# EAGLE design minipov (EAGLE 6.1)
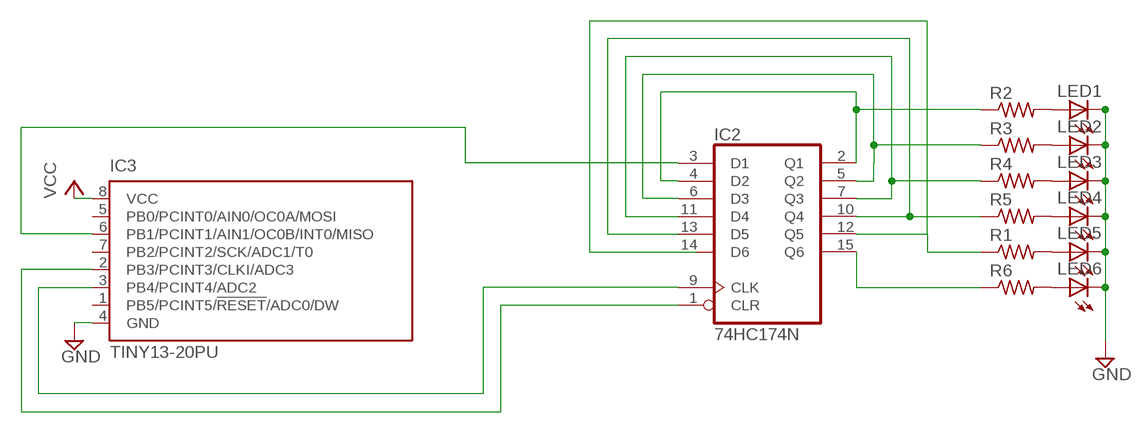
[diagram p0: schematic, sheet 1]

## Parts
IC2  74HC174N  [DIL16]
IC3  TINY13-20PU  [DIL08]
LED1  LED10MM  [LED10MM]
LED2  LED10MM  [LED10MM]
LED3  LED10MM  [LED10MM]
LED4  LED10MM  [LED10MM]
LED5  LED10MM  [LED10MM]
LED6  LED10MM  [LED10MM]
R1  R-US_0207/5V  [0207/5V]
R2  R-US_0207/5V  [0207/5V]
R3  R-US_0207/5V  [0207/5V]
R4  R-US_0207/5V  [0207/5V]
R5  R-US_0207/5V  [0207/5V]
R6  R-US_0207/5V  [0207/5V]

## Nets
GND: IC3.4(GND) LED1.K(C) LED2.K(C) LED3.K(C) LED4.K(C) LED5.K(C) LED6.K(C)
N$1: IC2.1(CLR) IC3.2(PB3/PCINT3/CLKI/ADC3)
N$2: IC2.9(CLK) IC3.3(PB4/PCINT4/ADC2)
N$3: IC2.3(D1) IC3.6(PB1/PCINT1/AIN1/OC0B/INT0/MISO)
N$6: IC2.7(Q3) IC2.11(D4) R4.1
N$7: IC2.10(Q4) IC2.13(D5) R5.1
N$8: IC2.12(Q5) R1.1
N$9: IC2.2(Q1) IC2.4(D2) R2.1
N$10: IC2.5(Q2) IC2.6(D3) R3.1
N$12: IC2.15(Q6) R6.1
N$13: LED1.A R2.2
N$14: LED2.A R3.2
N$15: LED3.A R4.2
N$16: LED4.A R5.2
N$17: LED5.A R1.2
N$18: LED6.A R6.2
VCC: IC3.8(VCC)
Unconnected: IC2.14(D6) IC3.1(PB5/PCINT5/!RESET!/ADC0/DW) IC3.5(PB0/PCINT0/AIN0/OC0A/MOSI) IC3.7(PB2/PCINT2/SCK/ADC1/T0)

## Power pins joined to a net without a drawn wire
GND: IC2.8(GND)
VCC: IC2.16(VCC)

## Library data of the parts
IC2 = 74xx-eu:74*174: Hex D type FLIP FLOP, clear
IC3 = atmel:TINY13: 8-bit AVR Microcontroller with 1K Bytes In-System Programmable Flash Source: http://www.atmel.com/dyn/resources/prod_documents/2535S.pdf; MPN: ATTINY13-20PU; OC_FARNELL: 9171550; OC_NEWARK: 96K6521
LED1-LED6 = led:LED: LED OSRAM: - CHIPLED LG R971, LG N971, LY N971, LG Q971, LY Q971, LO R971, LY R971 LH N974, LH R974 LS Q976, LO Q976, LY Q976 LO Q996 - Hyper CHIPLED LW Q18S LB Q993, LB Q99A, LB R99A - SideLED LS A670, LO A670, LY A670, LG A670, LP A670 LB A673, LV A673, LT A673, LW A673 LH A674 LY A675 LS A676, LA A676, LO A676, LY A676, LW A676 LS A679, LY A679, LG A679 - Hyper Micro SIDELED® LS Y876, LA Y876, LO Y876, LY Y876 LT Y87S - SmartLED LW L88C, LW L88S LB L89C, LB L89S, LG L890 LS L89K, LO L89K, LY L89K LS L896, LA L896, LO L896, LY L896 - TOPLED LS T670, LO T670, LY T670, LG T670, LP T670 LSG T670, LSP T670, LSY T670, LOP T670, LYG T670 LG T671, LOG T671, LSG T671 LB T673, LV T673, LT T673, LW T673 LH T674 LS T676, LA T676, LO T676, LY T676, LB T676, LH T676, LSB T676, LW T676 LB T67C, LV T67C, LT T67C, LS T67K, LO T67K, LY T67K, LW E67C LS E67B, LA E67B, LO E67B, LY E67B, LB E67C, LV E67C, LT E67C LW T67C LS T679, LY T679, LG T679 LS T770, LO T770, LY T770, LG T770, LP T770 LB T773, LV T773, LT T773, LW T773 LH T774 LS E675, LA E675, LY E675, LS T675 LS T776, LA T776, LO T776, LY T776, LB T776 LHGB T686 LT T68C, LB T68C - Hyper Mini TOPLED® LB M676 - Mini TOPLED Santana® LG M470 LS M47K, LO M47K, LY M47K Source: http://www.osram.convergy.de LUXEON: - LUMILED® LXK2-PW12-R00, LXK2-PW12-S00, LXK2-PW14-U00, LXK2-PW14-V00 LXK2-PM12-R00, LXK2-PM12-S00, LXK2-PM14-U00 LXK2-PE12-Q00, LXK2-PE12-R00, LXK2-PE12-S00, LXK2-PE14-T00, LXK2-PE14-U00 LXK2-PB12-K00, LXK2-PB12-L00, LXK2-PB12-M00, LXK2-PB14-N00, LXK2-PB14-P00, LXK2-PB14-Q00 LXK2-PR12-L00, LXK2-PR12-M00, LXK2-PR14-Q00, LXK2-PR14-R00 LXK2-PD12-Q00, LXK2-PD12-R00, LXK2-PD12-S00 LXK2-PH12-R00, LXK2-PH12-S00 LXK2-PL12-P00, LXK2-PL12-Q00, LXK2-PL12-R00 Source: www.luxeon.com KINGBRIGHT: KA-3528ASYC Source: www.kingbright.com
R1-R6 = resistor:R-US_: RESISTOR, American symbol

## Board
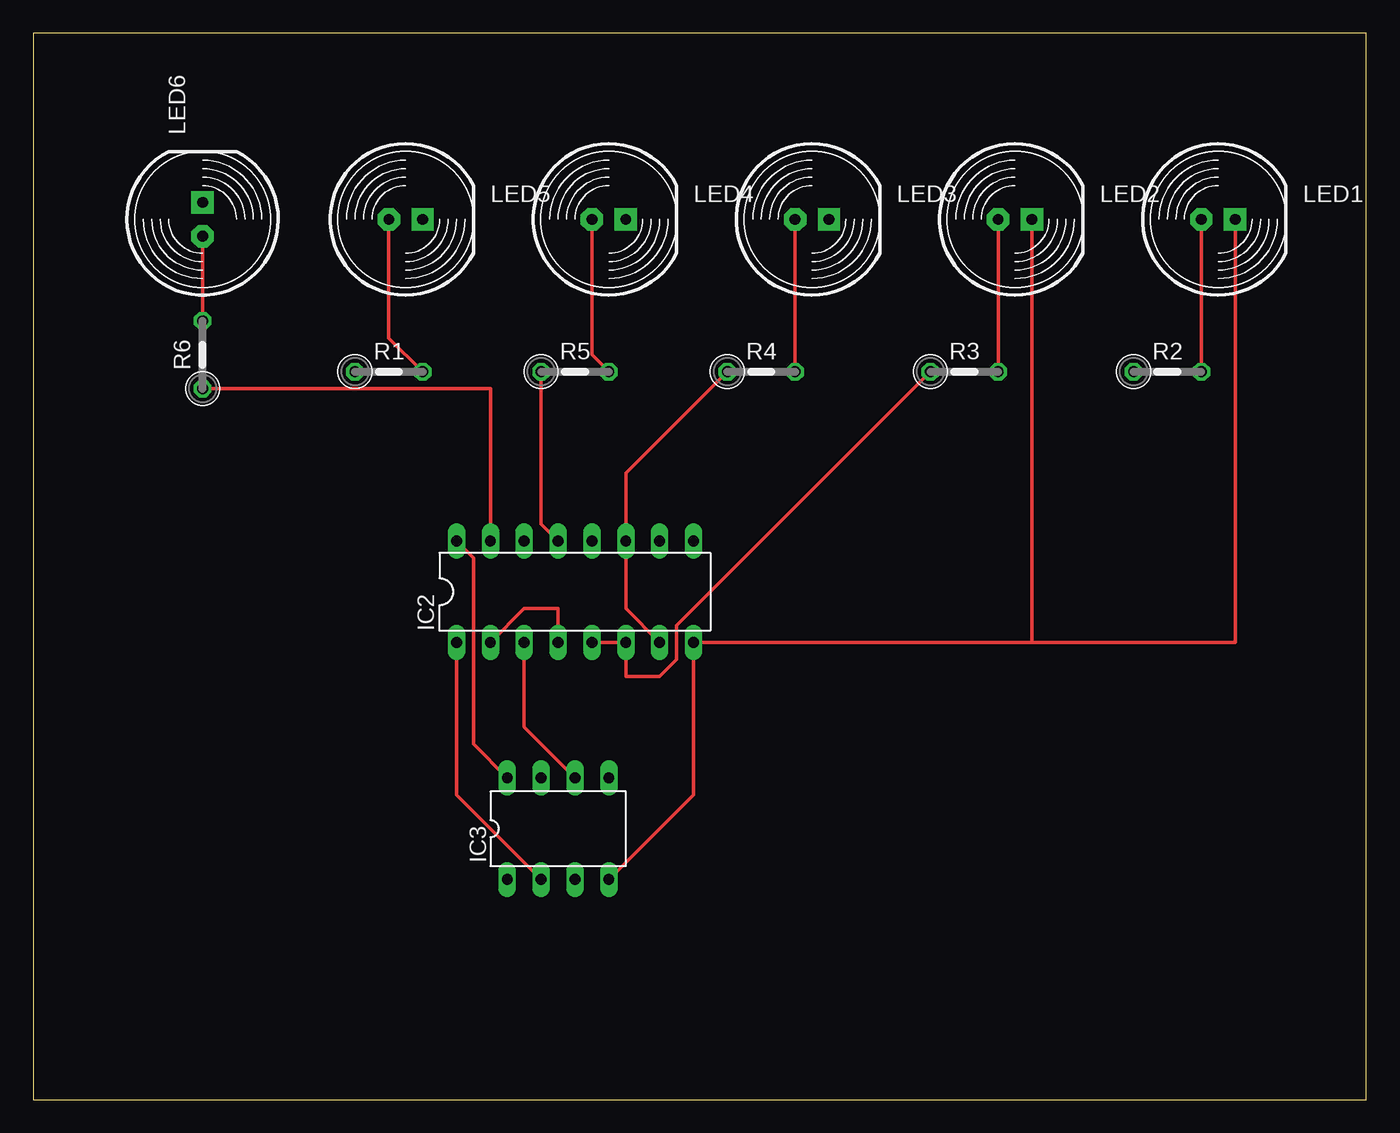
[diagram p1: board, top side]
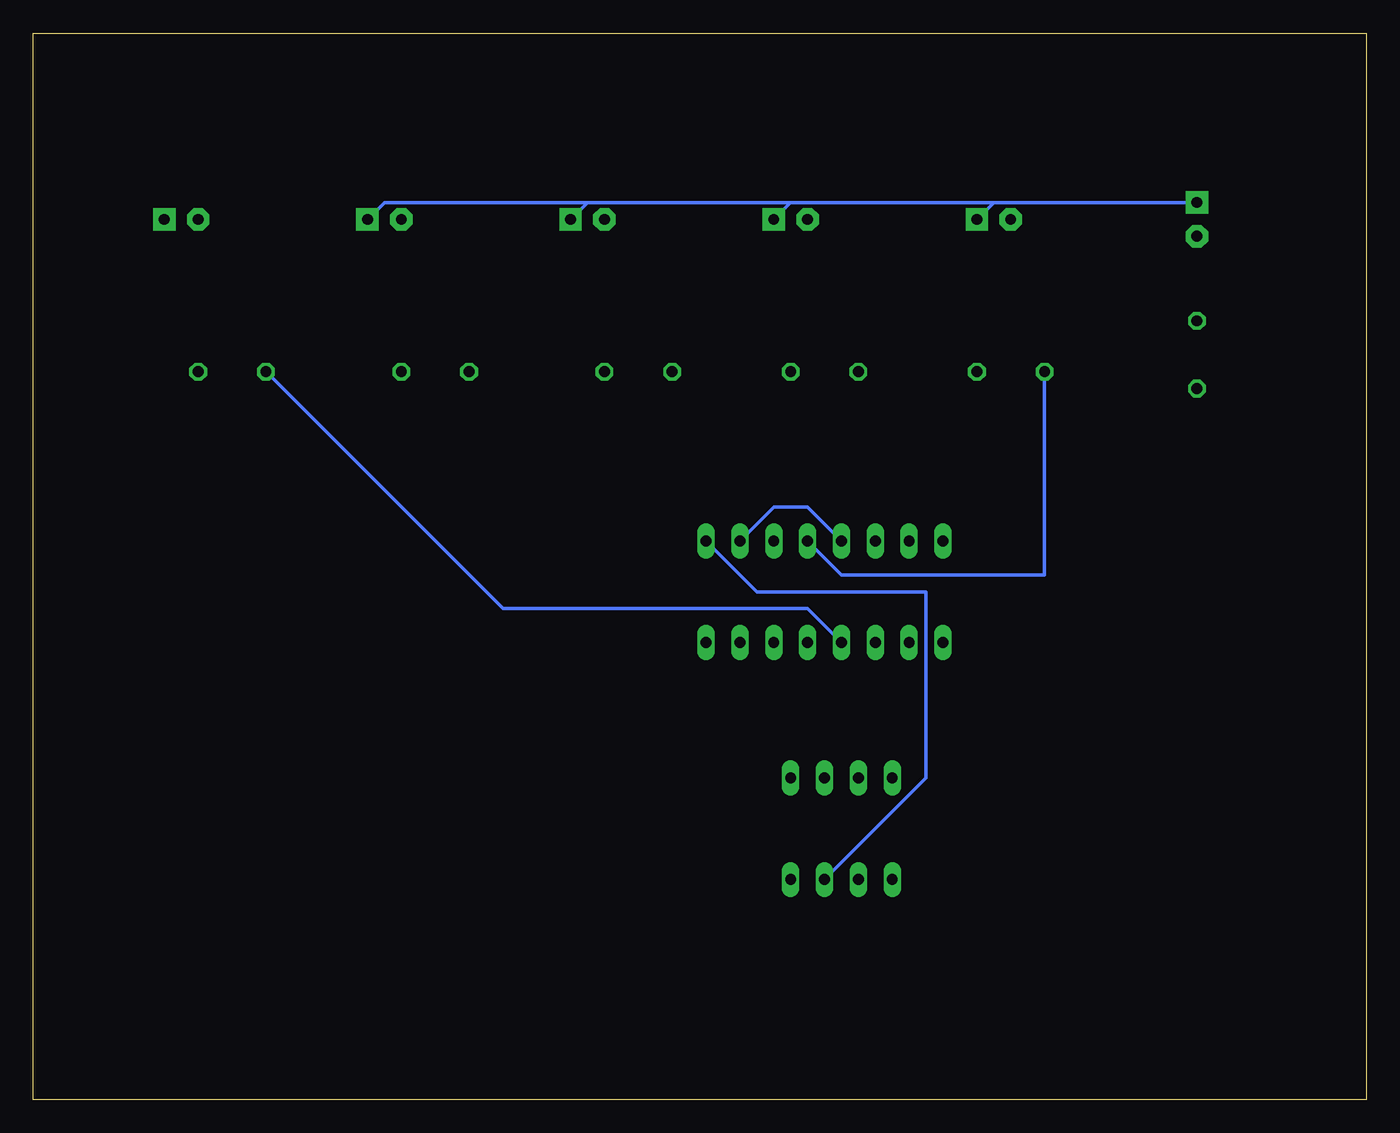
[diagram p2: board, bottom side, seen from below]

Size 100 x 80 mm. Coordinates in mm from the lower left corner, seen from the top.
Outline: 0,0 100,0 100,80 0,80 0,0
Copper layers (1*16): Top 0.035mm / dielectric 1.5mm / Bottom 0.035mm
Design rules: minimum track width 10mil, minimum drill 24mil, track to track 8mil, track to pad 8mil, pad to pad 8mil, via to via 8mil, smd to smd 8mil, copper to edge 40mil, drill to drill 8mil, minimum pad ring 10mil, minimum via ring 8mil, stop-mask expansion 4mil, vias tented up to drill 0mil, thermal gap 10mil

### Footprints (pad centres in the part's own frame; a part is rotated, then mirrored left to right if it is on the bottom)
DIL16 = drill 0.813 long: 1 -8.89,-3.81; 2 -6.35,-3.81; 3 -3.81,-3.81; 4 -1.27,-3.81; 5 1.27,-3.81; 6 3.81,-3.81; 7 6.35,-3.81; 8 8.89,-3.81; 9 8.89,3.81; 10 6.35,3.81; 11 3.81,3.81; 12 1.27,3.81; 13 -1.27,3.81; 14 -3.81,3.81; 15 -6.35,3.81; 16 -8.89,3.81
DIL08 = drill 0.813 long: 1 -3.81,-3.81; 2 -1.27,-3.81; 3 1.27,-3.81; 4 3.81,-3.81; 5 3.81,3.81; 6 1.27,3.81; 7 -1.27,3.81; 8 -3.81,3.81
LED10MM = drill 0.813 pad 1.676 octagon: A -1.27,0 | drill 0.813 pad 1.676 square: K 1.27,0
0207/5V = drill 0.813 octagon: 1 -2.54,0; 2 2.54,0

### Placement (x,y rotation side)
IC2  40.64,38.1 0 top
IC3  39.37,20.32 0 top
LED1  88.9,66.04 0 top
LED2  73.66,66.04 0 top
LED3  58.42,66.04 0 top
LED4  43.18,66.04 0 top
LED5  27.94,66.04 0 top
LED6  12.7,66.04 90 top
R1  26.67,54.61 0 top
R2  85.09,54.61 0 top
R3  69.85,54.61 0 top
R4  54.61,54.61 0 top
R5  40.64,54.61 0 top
R6  12.7,55.88 90 top

### Tracks (layer width: path | path; a pad name or v marks a point on that pad's centre or on a via)
GND
  Top 0.254: 74.93,34.29 90.17,34.29 LED1.K | 74.93,34.29 IC2.8 49.53,22.86 IC3.4 | 74.93,34.29 LED2.K
  Bottom 0.254: 27.94,67.31 LED5.K | LED6.K 27.94,67.31 | 43.18,67.31 LED4.K | 27.94,67.31 43.18,67.31 | 58.42,67.31 LED3.K | 43.18,67.31 58.42,67.31 | LED2.K 73.66,67.31 58.42,67.31
N$1
  Top 0.254: IC3.2 31.75,22.86 IC2.1
N$2
  Bottom 0.254: IC3.3 33.02,24.13 33.02,38.1 45.72,38.1 IC2.9
N$3
  Top 0.254: IC3.6 36.83,27.94 IC2.3
N$6
  Top 0.254: IC2.7 44.45,36.83 IC2.11 44.45,46.99 R4.1
N$7
  Top 0.254: IC2.13 38.1,43.18 R5.1
  Bottom 0.254: IC2.10 44.45,44.45 41.91,44.45 IC2.13
N$8
  Bottom 0.254: R1.1 24.13,39.37 39.37,39.37 IC2.12
N$9
  Top 0.254: IC2.2 36.83,36.83 39.37,36.83 IC2.4
  Bottom 0.254: R2.1 64.77,36.83 41.91,36.83 IC2.4
N$10
  Top 0.254: IC2.5 IC2.6 44.45,31.75 46.99,31.75 48.26,33.02 48.26,35.56 R3.1
N$12
  Top 0.254: R6.1 34.29,53.34 IC2.15
N$13
  Top 0.254: LED1.A R2.2
N$14
  Top 0.254: LED2.A R3.2
N$15
  Top 0.254: LED3.A R4.2
N$16
  Top 0.254: R5.2 41.91,55.88 LED4.A
N$17
  Top 0.254: R1.2 26.67,57.15 LED5.A
N$18
  Top 0.254: LED6.A R6.2
VCC
  Top 0.254: IC3.8 33.02,26.67 33.02,40.64 IC2.16